# EAGLE design Blimp Control V0.3 (EAGLE 6.5.0)
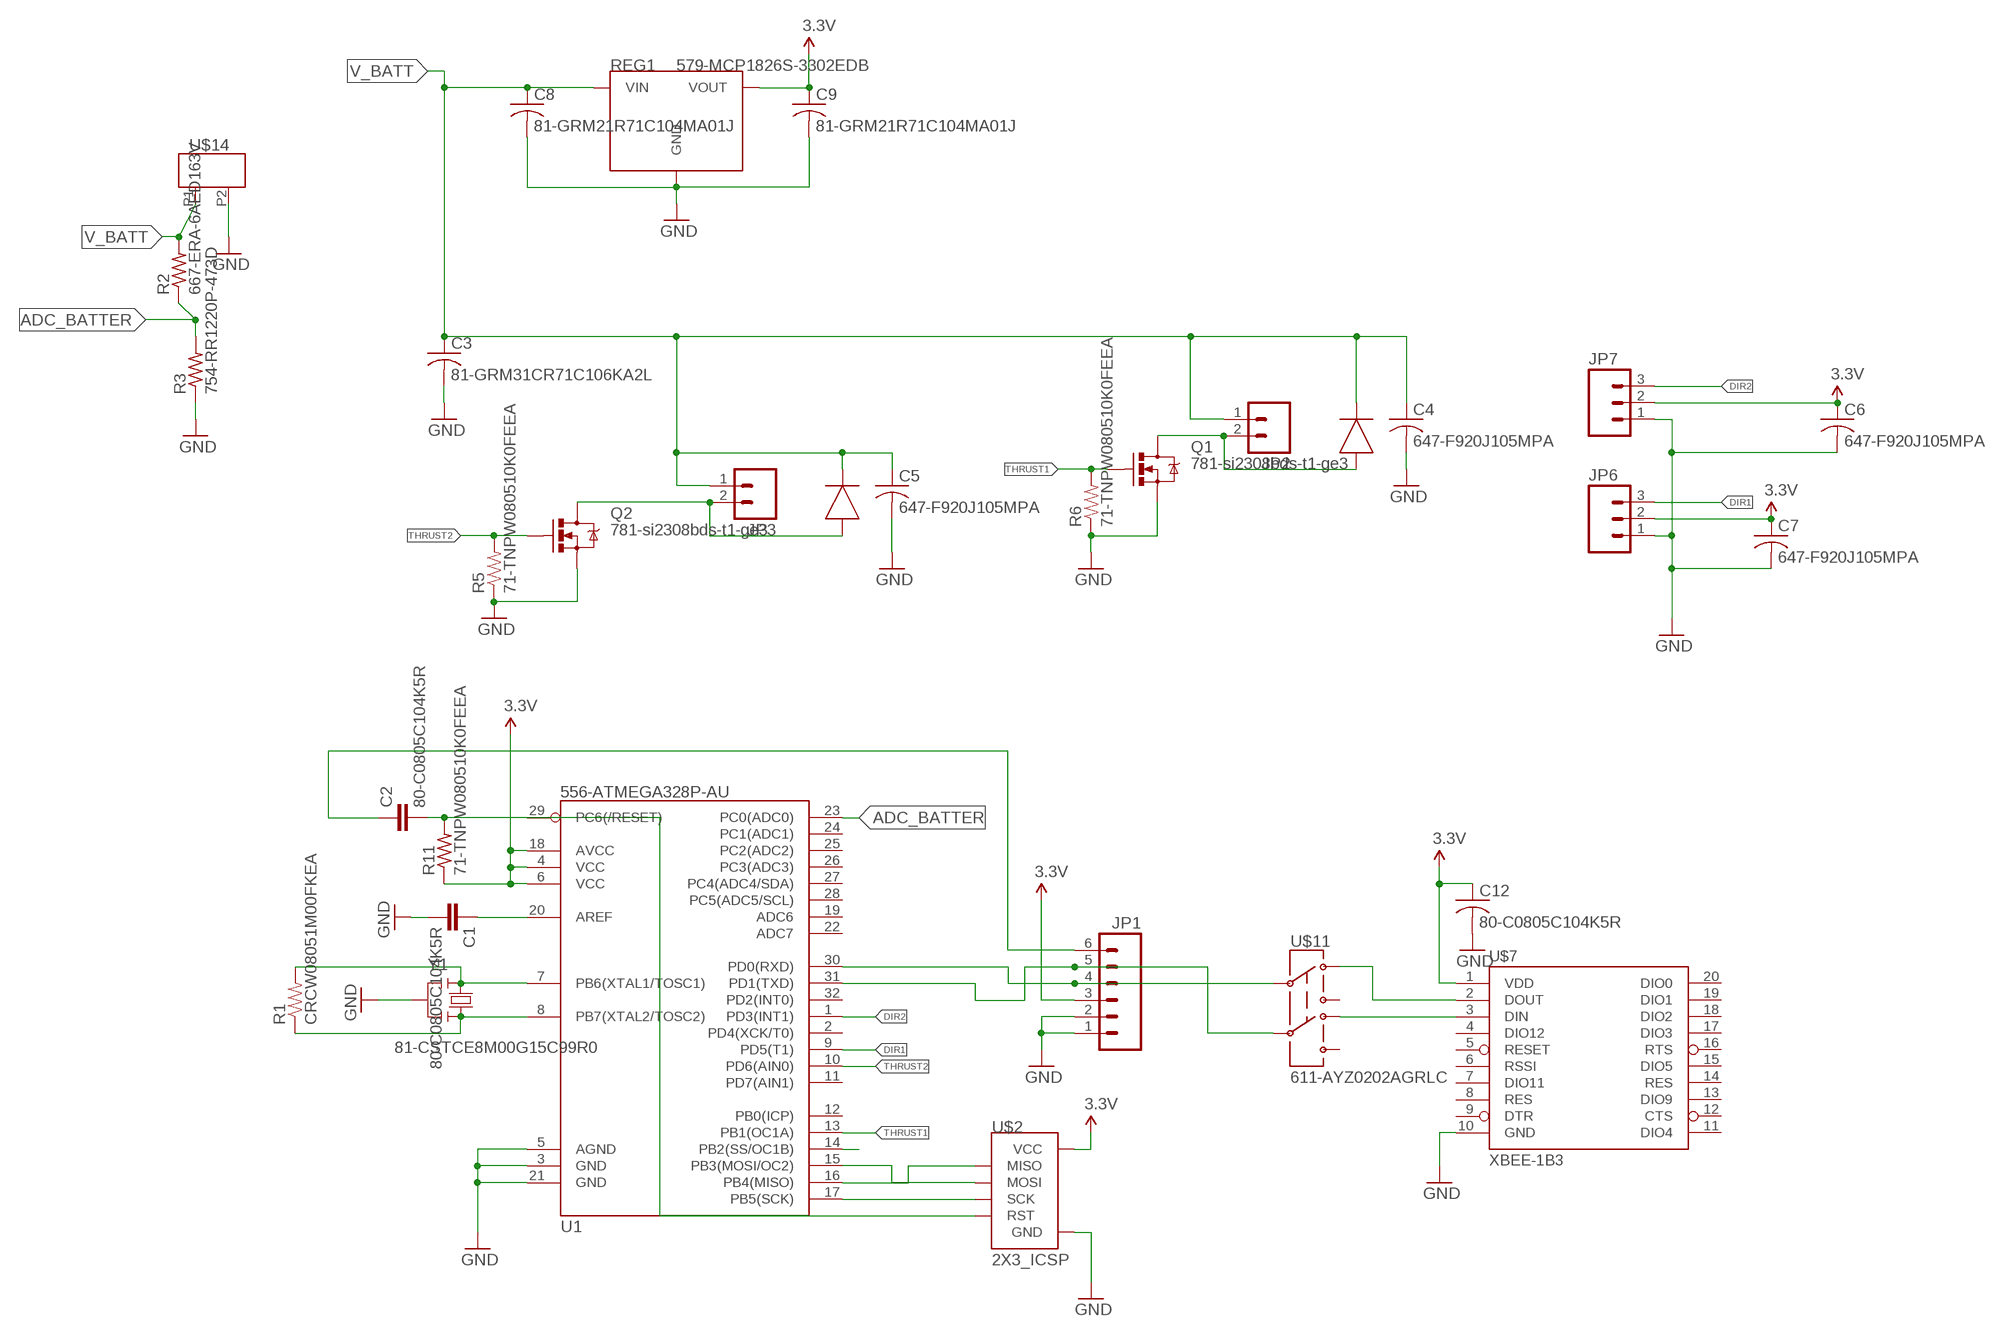
[diagram p0: schematic, sheet 1]

## Parts
C1  80-C0805C104K5R  CAP0805  [0805]
C2  80-C0805C104K5R  CAP0805  [0805]
C3  81-GRM31CR71C106KA2L  C-USC1206  [C1206]
C4  647-F920J105MPA  C-USC0805  [C0805]
C5  647-F920J105MPA  C-USC0805  [C0805]
C6  647-F920J105MPA  C-USC0805  [C0805]
C7  647-F920J105MPA  C-USC0805  [C0805]
C8  81-GRM21R71C104MA01J  C-USC0805  [C0805]
C9  81-GRM21R71C104MA01J  C-USC0805  [C0805]
C12  80-C0805C104K5R  C-USC0805  [C0805]
D1  621-SBR07U20LPS-7  DIODESBR07U20LPS  [X2-DFN1006-2]
D2  621-SBR07U20LPS-7  DIODESBR07U20LPS  [X2-DFN1006-2]
JP1  M06LOCK  [1X06_LOCK]
JP2  M02PTH  [1X02]
JP3  M02PTH  [1X02]
JP6  M03LOCK  [1X03_LOCK]
JP7  M03LOCK  [1X03_LOCK]
Q1  781-si2308bds-t1-ge3  MOSFET-NCHANNELSMD  [SOT23-3]
Q2  781-si2308bds-t1-ge3  MOSFET-NCHANNELSMD  [SOT23-3]
R1  CRCW08051M00FKEA  RESISTOR  [0805]
R2  667-ERA-6AED163V  R-US_R0805  [R0805]
R3  754-RR1220P-473D  R-US_R0805  [R0805]
R5  71-TNPW080510K0FEEA  RESISTOR  [0805]
R6  71-TNPW080510K0FEEA  RESISTOR  [0805]
R11  71-TNPW080510K0FEEA  R-US_R0805  [R0805]
REG1  579-MCP1826S-3302EDB  LDO_3_PORTMCP1826S  [SOT-223-3]
U1  556-ATMEGA328P-AU  ATMEGA168  [TQFP32-08]
U$2  2X3_ICSP  [2X3_ICSP]
U$7  XBEE-1B3  [XBEE-SMD]
U$11  611-AYZ0202AGRLC  SWITCH-DPDTSMD  [AYZ0202]
U$14  538-53047-0210  MOLEX_2POLE_PICO  [MOLEX_2POLE_PICO]
Y1  81-CSTCE8M00G15C99R0  RESONATORMU  [RESONATOR]

## Nets
3.3V: C6.1 C7.1 C9.1 C12.1 JP1.3 JP6.2 JP7.2 R11.1 REG1.3(VOUT) U1.4(VCC) U1.6(VCC) U1.18(AVCC) U$2.VCC U$7.1(VDD)
ADC_BATTER: R2.1 R3.2 U1.23(PC0(ADC0))
ARDUINO_TX: JP1.5 U1.31(PD1(TXD)) U$11.5
DIR1: JP6.3 U1.9(PD5(T1))
DIR2: JP7.3 U1.1(PD3(INT1))
GND: C1.2 C3.2 C4.2 C5.2 C6.2 C7.2 C8.2 C9.2 C12.2 JP1.1 JP1.2 JP6.1 JP7.1 Q1.2(S) Q2.2(S) R3.1 R5.1 R6.1 REG1.2(GND) REG1.4(GND) U1.3(GND) U1.5(AGND) U1.21(GND) U$2.GND U$7.10(GND) U$14.P2 Y1.2
N$1: R1.2 U1.7(PB6(XTAL1/TOSC1)) Y1.1
N$2: R1.1 U1.8(PB7(XTAL2/TOSC2)) Y1.3
N$3: C1.1 U1.20(AREF)
N$4: C2.2 R11.2 U1.29(PC6(/RESET)) U$2.RST
N$5: JP1.4 U1.30(PD0(RXD)) U$11.2
N$6: U1.17(PB5(SCK)) U$2.SCK
N$7: U1.15(PB3(MOSI/OC2)) U$2.MOSI
N$8: U1.16(PB4(MISO)) U$2.MISO
N$9: U$7.2(DOUT) U$11.1
N$10: C2.1 JP1.6
N$11: U1.14(PB2(SS/OC1B))
N$12: U$7.3(DIN) U$11.4
N$13: D2.A JP2.2 Q1.3(D)
N$16: D1.A JP3.2 Q2.3(D)
THRUST1: Q1.1(G) R6.2 U1.13(PB1(OC1A))
THRUST2: Q2.1(G) R5.2 U1.10(PD6(AIN0))
V_BATT: C3.1 C4.1 C5.1 C8.1 D1.C D2.C JP2.1 JP3.1 R2.2 REG1.1(VIN) U$14.P1
Unconnected: U1.2(PD4(XCK/T0)) U1.11(PD7(AIN1)) U1.12(PB0(ICP)) U1.19(ADC6) U1.22(ADC7) U1.24(PC1(ADC1)) U1.25(PC2(ADC2)) U1.26(PC3(ADC3)) U1.27(PC4(ADC4/SDA)) U1.28(PC5(ADC5/SCL)) U1.32(PD2(INT0)) U$7.4(DIO12) U$7.5(RESET) U$7.6(RSSI) U$7.7(DIO11) U$7.8(RES) U$7.9(DTR) U$7.11(DIO4) U$7.12(CTS) U$7.13(DIO9) U$7.14(RES) U$7.15(DIO5) U$7.16(RTS) U$7.17(DIO3) U$7.18(DIO2) U$7.19(DIO1) U$7.20(DIO0) U$11.3 U$11.6

## Library data of the parts
C1 C2 = SparkFun2:CAP: Capacitor Standard 0603 ceramic capacitor, and 0.1" leaded capacitor.
C3-C9 C12 = Kibler_Passives:C-US: CAPACITOR, American symbol
D1 D2 = Kibler_Components:DIODE
JP1 = SparkFun2:M06: Header 6 Standard 6-pin 0.1" header. Use with straight break away headers (SKU : PRT-00116), right angle break away headers (PRT-00553), swiss pins (PRT-00743), machine pins (PRT-00117), and female headers (PRT-00115). Molex polarized connector foot print use with SKU : PRT-08094 with associated crimp pins and housings. NOTES ON THE VARIANTS LOCK and LOCK_LONGPADS... This footprint was designed to help hold the alignment of a through-hole component (i.e. 6-pin header) while soldering it into place. You may notice that each hole has been shifted either up or down by 0.005 of an inch from it's more standard position (which is a perfectly straight line). This slight alteration caused the pins (the squares in the middle) to touch the edges of the holes. Because they are alternating, it causes a "brace" to hold the component in place. 0.005 has proven to be the perfect amount of "off-center" position when using our standard breakaway headers. Although looks a little odd when you look at the bare footprint, once you have a header in there, the alteration is very hard to notice. Also, if you push a header all the way into place, it is covered up entirely on the bottom side. This idea of altering the position of holes to aid alignment will be further integrated into the Sparkfun Library for other footprints. It can help hold any component with 3 or more connection pins.
JP2 JP3 = SparkFun2:M02: Header 2 Standard 2-pin 0.1" header. Use with straight break away headers (SKU : PRT-00116), right angle break away headers (PRT-00553), swiss pins (PRT-00743), machine pins (PRT-00117), and female headers (PRT-00115). Molex polarized connector foot print use with SKU : PRT-08233 with associated crimp pins and housings.
JP6 JP7 = SparkFun2:M03: Header 3 Standard 3-pin 0.1" header. Use with straight break away headers (SKU : PRT-00116), right angle break away headers (PRT-00553), swiss pins (PRT-00743), machine pins (PRT-00117), and female headers (PRT-00115). Molex polarized connector foot print use with SKU : PRT-08232 with associated crimp pins and housings.
Q1 Q2 = SparkFun2:MOSFET-NCHANNEL
R1 R5 R6 = SparkFun2:RESISTOR: Resistor Basic schematic elements and footprints for 0603, 1206, and PTH 1/10th watt (small) resistors.
R2 R3 R11 = Kibler_Passives:R-US_: RESISTOR, American symbol
REG1 = Kibler_Power:LDO_3_PORT
U1 = SparkFun2:ATMEGA168
U$2 = Kibler:2X3_ICSP
U$7 = SparkFun2:XBEE-1
U$11 = SparkFun2:SWITCH-DPDT: DPDT Version of the COM-00597, MSS22 is a 125VAC @ 300mA rated switch
U$14 = Kibler:MOLEX_2POLE_PICO
Y1 = SmartPrj:RESONATOR

## Board
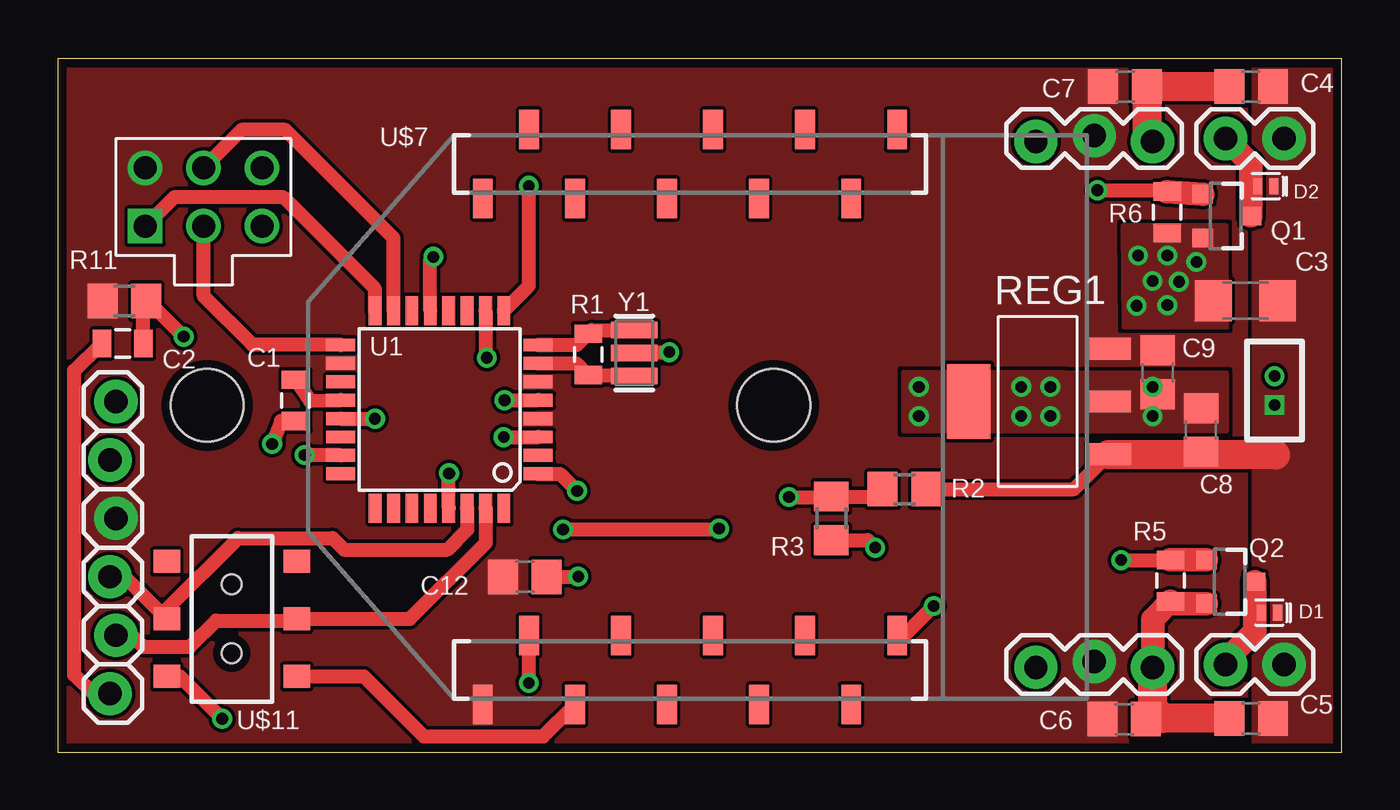
[diagram p1: board, top side]
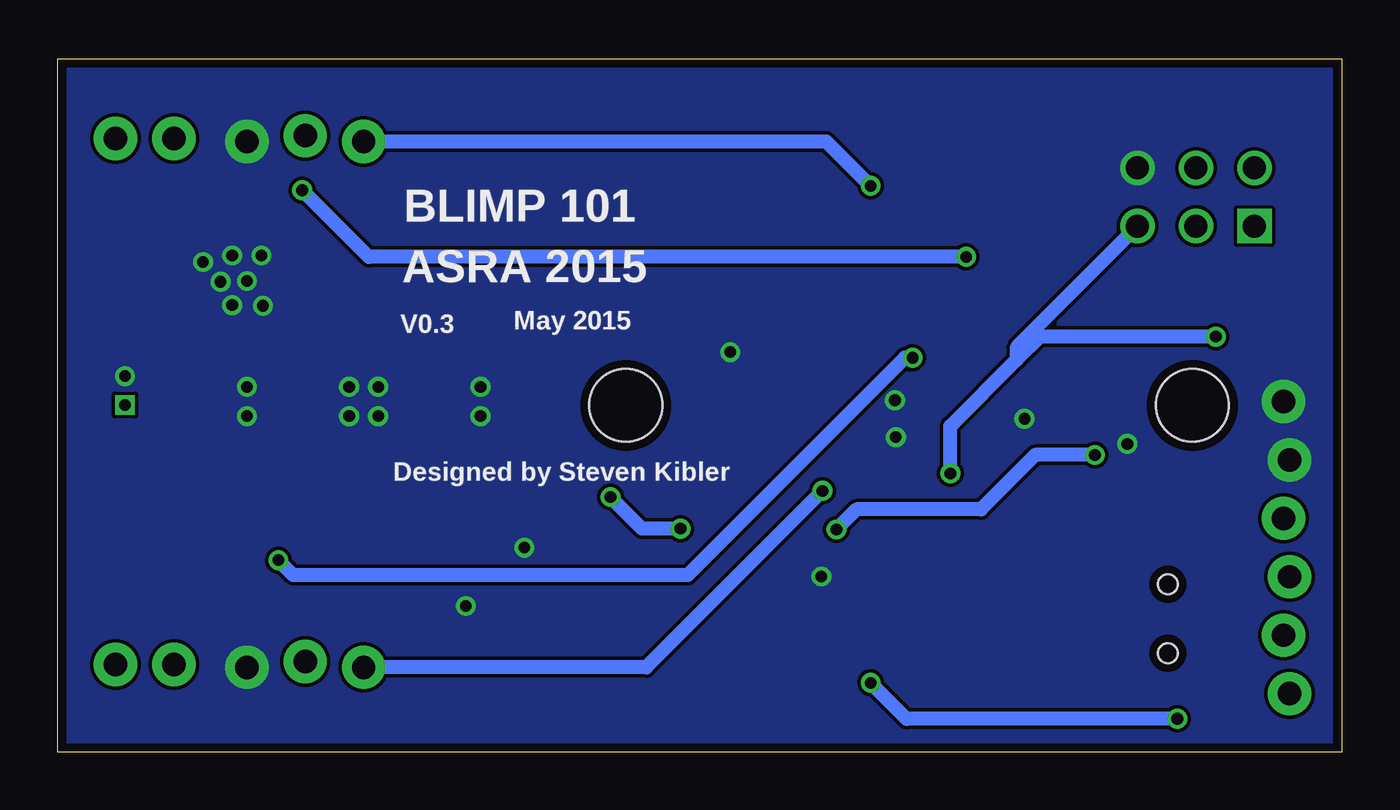
[diagram p2: board, bottom side, seen from below]

Size 55.86 x 30.15 mm. Coordinates in mm from the lower left corner, seen from the top.
Outline: 0,0 55.86,0 55.86,30.15 0,30.15 0,0
Copper layers (1*16): Top 0.0356mm / dielectric 1.5011mm / Bottom 0.0356mm
Design rules "LaenPCBOrder *": minimum track width 6mil, minimum drill 13mil, track to track 6mil, track to pad 6mil, pad to pad 6mil, via to via 6mil, smd to smd 0mil, copper to edge 15mil, drill to drill 6mil, minimum pad ring 7mil, minimum via ring 7mil, stop-mask expansion 3mil, vias tented up to drill 24mil, thermal gap 10mil
Holes 3.17 mm at 31.15,15.07 6.51,15.07

### Footprints (pad centres in the part's own frame; a part is rotated, then mirrored left to right if it is on the bottom)
0805 = smd 0.8 x 1.2: 1 -0.9,0; 2 0.9,0
C1206 = smd 1.6 x 1.8: 1 -1.4,0; 2 1.4,0
C0805 = smd 1.3 x 1.5: 1 -0.95,0; 2 0.95,0
X2-DFN1006-2 = smd 0.4 x 0.7: A -0.35,0; C 0.35,0
1X06_LOCK = drill 1.016 pad 1.88: 1 0,0; 2 2.54,-0.254; 3 5.08,0; 4 7.62,-0.254; 5 10.16,0; 6 12.7,-0.254
1X02 = drill 1.016 pad 1.88: 1 0,0; 2 2.54,0
1X03_LOCK = drill 1.016 pad 1.88: 1 0,0.127; 2 2.54,-0.127; 3 5.08,0.127
SOT23-3 = smd 0.8 x 0.9: 1 -0.95,-1; 2 0.95,-1; 3 0,1.1
R0805 = smd 1.3 x 1.5: 1 -0.95,0; 2 0.95,0
SOT-223-3 = smd 0.95 x 1.9: 1 -2.3,0; 2 0,0; 3 2.3,0 | smd 3.25 x 1.9: 4 0,6.1
TQFP32-08 = smd 1.27 x 0.559: 1 -4.293,2.8; 2 -4.293,2; 3 -4.293,1.2; 4 -4.293,0.4; 5 -4.293,-0.4; 6 -4.293,-1.2; 7 -4.293,-2; 8 -4.293,-2.8; 17 4.293,-2.8; 18 4.293,-2; 19 4.293,-1.2; 20 4.293,-0.4; 21 4.293,0.4; 22 4.293,1.2; 23 4.293,2; 24 4.293,2.8 | smd 0.559 x 1.27: 9 -2.8,-4.293; 10 -2,-4.293; 11 -1.2,-4.293; 12 -0.4,-4.293; 13 0.4,-4.293; 14 1.2,-4.293; 15 2,-4.293; 16 2.8,-4.293; 25 2.8,4.293; 26 2,4.293; 27 1.2,4.293; 28 0.4,4.293; 29 -0.4,4.293; 30 -1.2,4.293; 31 -2,4.293; 32 -2.8,4.293
2X3_ICSP = drill 1: GND 1.27,-2.54; MOSI 1.27,0; RST -1.27,-2.54; SCK -1.27,0; VCC 1.27,2.54 | drill 1 square: MISO -1.27,2.54
XBEE-SMD = smd 1.7 x 0.85: 1 -12.5,20; 2 -9.5,18; 3 -12.5,16; 4 -9.5,14; 5 -12.5,12; 6 -9.5,10; 7 -12.5,8; 8 -9.5,6; 9 -12.5,4; 10 -9.5,2; 11 12.5,2; 12 9.5,4; 13 12.5,6; 14 9.5,8; 15 12.5,10; 16 9.5,12; 17 12.5,14; 18 9.5,16; 19 12.5,18; 20 9.5,20
AYZ0202 = smd 1 x 1.15: 1 -2.5,2.825; 2 0,2.825; 3 2.5,2.825; 4 -2.5,-2.825; 5 0,-2.825; 6 2.5,-2.825 | hole 0.85: 1.5,0; -1.5,0
MOLEX_2POLE_PICO = drill 0.5 square: P1 0.625,0 | drill 0.5: P2 -0.625,0
RESONATOR = smd 0.7 x 2: 1 -1,0; 2 0,0; 3 1,0

### Placement (x,y rotation side)
C1  10.35,15.28 270 top
C2  2.83,17.75 0 top
C3  51.66,19.62 180 top
C4  51.91,28.92 180 top
C5  51.91,1.46 180 top
C6  46.39,1.43 0 top
C7  46.42,28.92 0 top
C8  49.72,14 90 top
C9  47.85,16.51 270 top
C12  20.32,7.62 0 top
D1  52.7,6.06 0 top
D2  52.55,24.61 0 top
JP1  2.54,15.24 270 top
JP2  53.34,26.67 180 top
JP3  53.34,3.81 180 top
JP6  47.62,26.67 180 top
JP7  47.62,3.81 180 top
Q1  50.8,23.3 270 top
Q2  50.97,7.4 270 top
R1  23.08,17.28 270 top
R2  36.83,11.43 0 top
R3  33.66,10.16 90 top
R5  48.4,7.45 90 top
R6  48.26,23.46 90 top
R11  2.91,19.61 0 top
REG1  45.72,15.24 90 top
U1  16.61,14.9 180 top
U$2  6.35,24.13 90 top
U$7  38.51,14.57 90 top
U$11  7.58,5.79 90 top
U$14  52.93,15.72 270 top
Y1  25.08,17.35 90 top

### Tracks (layer width: path | path; a pad name or v marks a point on that pad's centre or on a via)
3.3V
  pour Top (rank 2, no thermals): -1.27,31.11 -1.27,-1.27 57.78,-1.27 57.78,31.11
ADC_BATTER  (via drill 0.51)
  Top 0.61: R2.1 35.56,11.11 R3.2 33.63,11.09 v31.81,11.09 | U1.23 10.76,12.9 v10.74,12.92 | v21.98,9.68 28.73,9.68 v28.77,9.72
  Bottom 0.61: v10.74,12.92 13.34,12.92 15.7,10.55 21.11,10.55 v21.98,9.68 | v28.77,9.72 30.44,9.72 v31.81,11.09
ARDUINO_TX
  Top 0.61: JP1.5 3.23,5.08 3.73,4.57 5.75,4.57 6.9,5.71 10.33,5.71 U$11.5 15.32,5.79 18.63,9.11 18.63,10.59 U1.31
DIR1  (via drill 0.51)
  Top 0.61: U1.9 20.5,20.28 v20.5,24.61
  Bottom 0.61: v20.5,24.61 22.43,26.54 JP6.3
DIR2  (via drill 0.51)
  Top 0.61: U1.1 21.85,12.1 v22.59,11.35
  Bottom 0.61: v22.59,11.35 30.26,3.68 JP7.3
GND  (via drill 0.51)
  Top 0.61: U$7.10 36.82,5.07 v38.1,6.35 | R3.1 35.24,9.21 v35.56,8.89 | C1.2 9.72,14.38 v9.34,13.4 | U1.21 v13.8,14.49 | v19.41,13.69 v19.41,13.7 U1.3 | v19.44,15.29 v19.45,15.3 U1.5 | C12.2 21.28,7.63 v22.64,7.63 | Y1.2 25.12,17.39 v26.61,17.39
  Top 1.016: Q2.2 48.5,6.45 R5.1 47.62,5.78 JP7.1
  Top 1.27: C5.2 48.07,1.46 47.62,1.91 | 47.62,1.91 JP7.1 | C6.2 47.34,1.62 47.62,1.91 | C4.2 C7.2 47.37,26.8 JP6.1
  other vias: 48.26,21.59 49.53,21.3 46.99,21.59 47.62,20.48 48.77,20.45 46.93,19.4 48.26,19.43 41.91,15.88 43.18,15.88 41.91,14.61 43.18,14.61 37.47,14.61 37.47,15.88 47.62,15.88 47.62,14.61
  pour Bottom (rank 2, no thermals): -0.64,30.48 -0.64,-0.64 56.52,-0.64 56.52,30.48
  pour Top (no thermals): 46.35,22.86 46.39,18.51 50.83,18.51 50.8,22.86
  pour Top (no thermals): 36.83,16.51 50.8,16.48 50.8,13.94 36.83,13.97
N$1
  Top 0.61: U1.7 22.56,16.9 R1.2 25.05,16.39 Y1.1
N$2
  Top 0.61: U1.8 22.59,17.7 R1.1 23.24,18.35 Y1.3
N$3
  Top 0.61: C1.1 10.98,15.27 U1.20
N$4  (via drill 0.51)
  Top 0.61: C2.2 3.73,19.48 R11.2 3.94,19.61 v5.49,18.06 | U1.29 17.01,12.1 v17.03,12.12
  Bottom 0.61: 14.13,17.07 14.13,17.61 U$2.RST | v5.49,18.06 13.14,18.06 14.13,17.07 | v17.03,12.12 17.03,14.17 14.13,17.07
N$5
  Top 0.61: JP1.4 2.93,7.62 U$11.2 4.76,6.21 7.85,9.3 11.96,9.3 12.46,8.8 16.95,8.8 17.83,9.68 17.83,10.59 U1.30
N$6
  Top 0.61: U1.17 8.48,17.7 6.36,19.81 6.36,22.85 U$2.SCK
N$7
  Top 0.61: U1.15 14.61,22.34 9.91,27.05 8,27.05 U$2.MOSI
N$8
  Top 0.61: U1.16 13.81,20.14 9.83,24.12 5.07,24.12 U$2.MISO
N$9  (via drill 0.51)
  Top 0.61: U$11.1 5.32,3.29 v7.16,1.45 | v20.5,3.01 20.5,5.06 U$7.2
  Bottom 0.61: v7.16,1.45 18.94,1.45 v20.5,3.01
N$10
  Top 0.61: JP1.6 1.57,2.54 0.72,3.35 0.72,16.58 C2.1
N$12
  Top 0.61: U$11.4 13.32,3.29 15.93,0.69 21.12,0.69 U$7.3
N$13
  Top 0.254: 51.9,23.81 51.9,24.06
  Top 0.305: D2.A 52.2,24.11 51.9,23.81
  Top 1.016: Q1.3 51.9,23.81 51.9,25.57 JP2.2
N$16
  Top 0.305: 52.06,5.84 52.14,5.84 D1.A
  Top 0.61: JP3.2 50.8,3.99
  Top 1.016: Q2.3 52.06,5.84 52.06,5.25 50.8,3.99
THRUST1  (via drill 0.51)
  Top 0.61: U1.13 16.21,21.39 v16.34,21.53 | v45.23,24.42 48.23,24.42 R6.2
  Top 1.016: Q1.1 48.25,24.35 R6.2
  Bottom 0.61: v16.34,21.53 42.33,21.53 v45.23,24.42
THRUST2  (via drill 0.51)
  Top 0.61: U1.10 18.61,17.2 v18.67,17.14 | v46.25,8.34 R5.2
  Top 1.016: Q2.1 R5.2
  Bottom 0.61: v18.67,17.14 19.01,17.14 28.46,7.7 45.61,7.7 v46.25,8.34
V_BATT
  Top 0.61: R2.2 44.21,11.43 REG1.1 | C8.1 52.37,13.05 52.48,12.94
  Top 1.27: REG1.1 52.48,12.94 52.94,12.94 52.96,12.92
  pour Top (no thermals): 52.07,29.84 55.88,29.84 55.88,0 52.07,0

### Text on the board
bNames: BLIMP 101 | ASRA 2015 | May 2015 | V0.3 | Designed by Steven Kibler